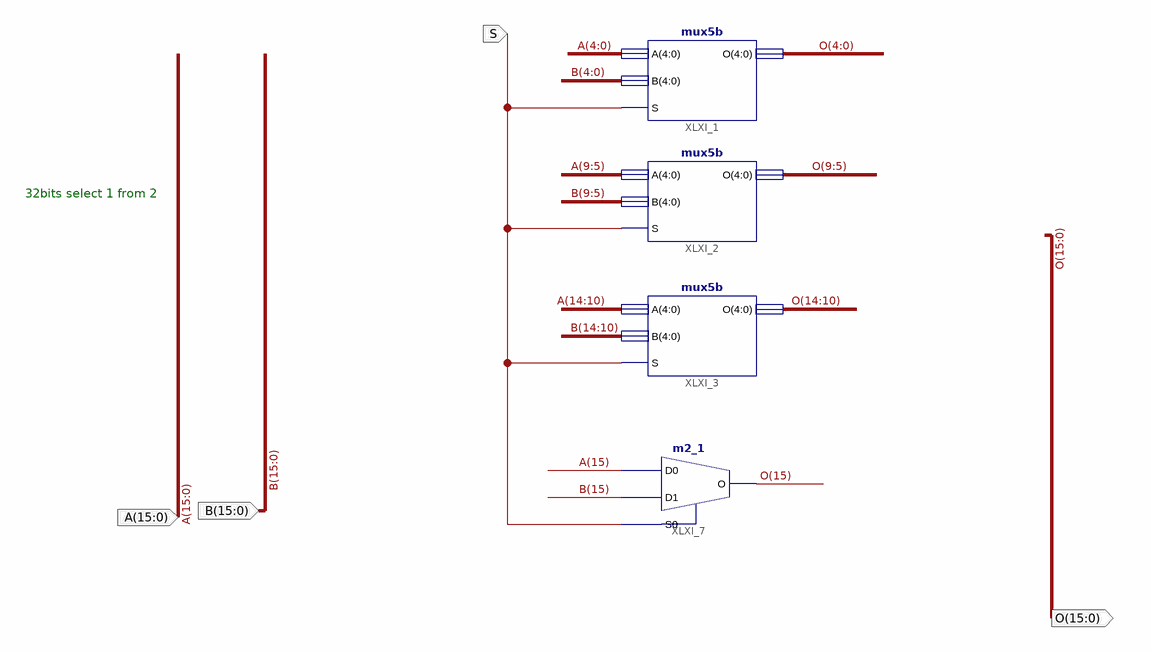
[diagram p0: schematic sheet 1]
// Xilinx ISE schematic mux16.sch (artix7) as structural Verilog: 4 symbols, 4 ports
module mux16 (
  input  [15:0] A,
  input  [15:0] B,
  input  S,
  output [15:0] O
);

  mux5b XLXI_1 (.A(A[4:0]), .B(B[4:0]), .S(S), .O(O[4:0]));
  mux5b XLXI_2 (.A(A[9:5]), .B(B[9:5]), .S(S), .O(O[9:5]));
  mux5b XLXI_3 (.A(A[14:10]), .B(B[14:10]), .S(S), .O(O[14:10]));
  m2_1 XLXI_7 (.D0(A[15]), .D1(B[15]), .S0(S), .O(O[15]));

  // Notes on the sheet:
  //   32bits select 1 from 2
endmodule
